# EAGLE design cwg-v2.0 (EAGLE 7.7.0)
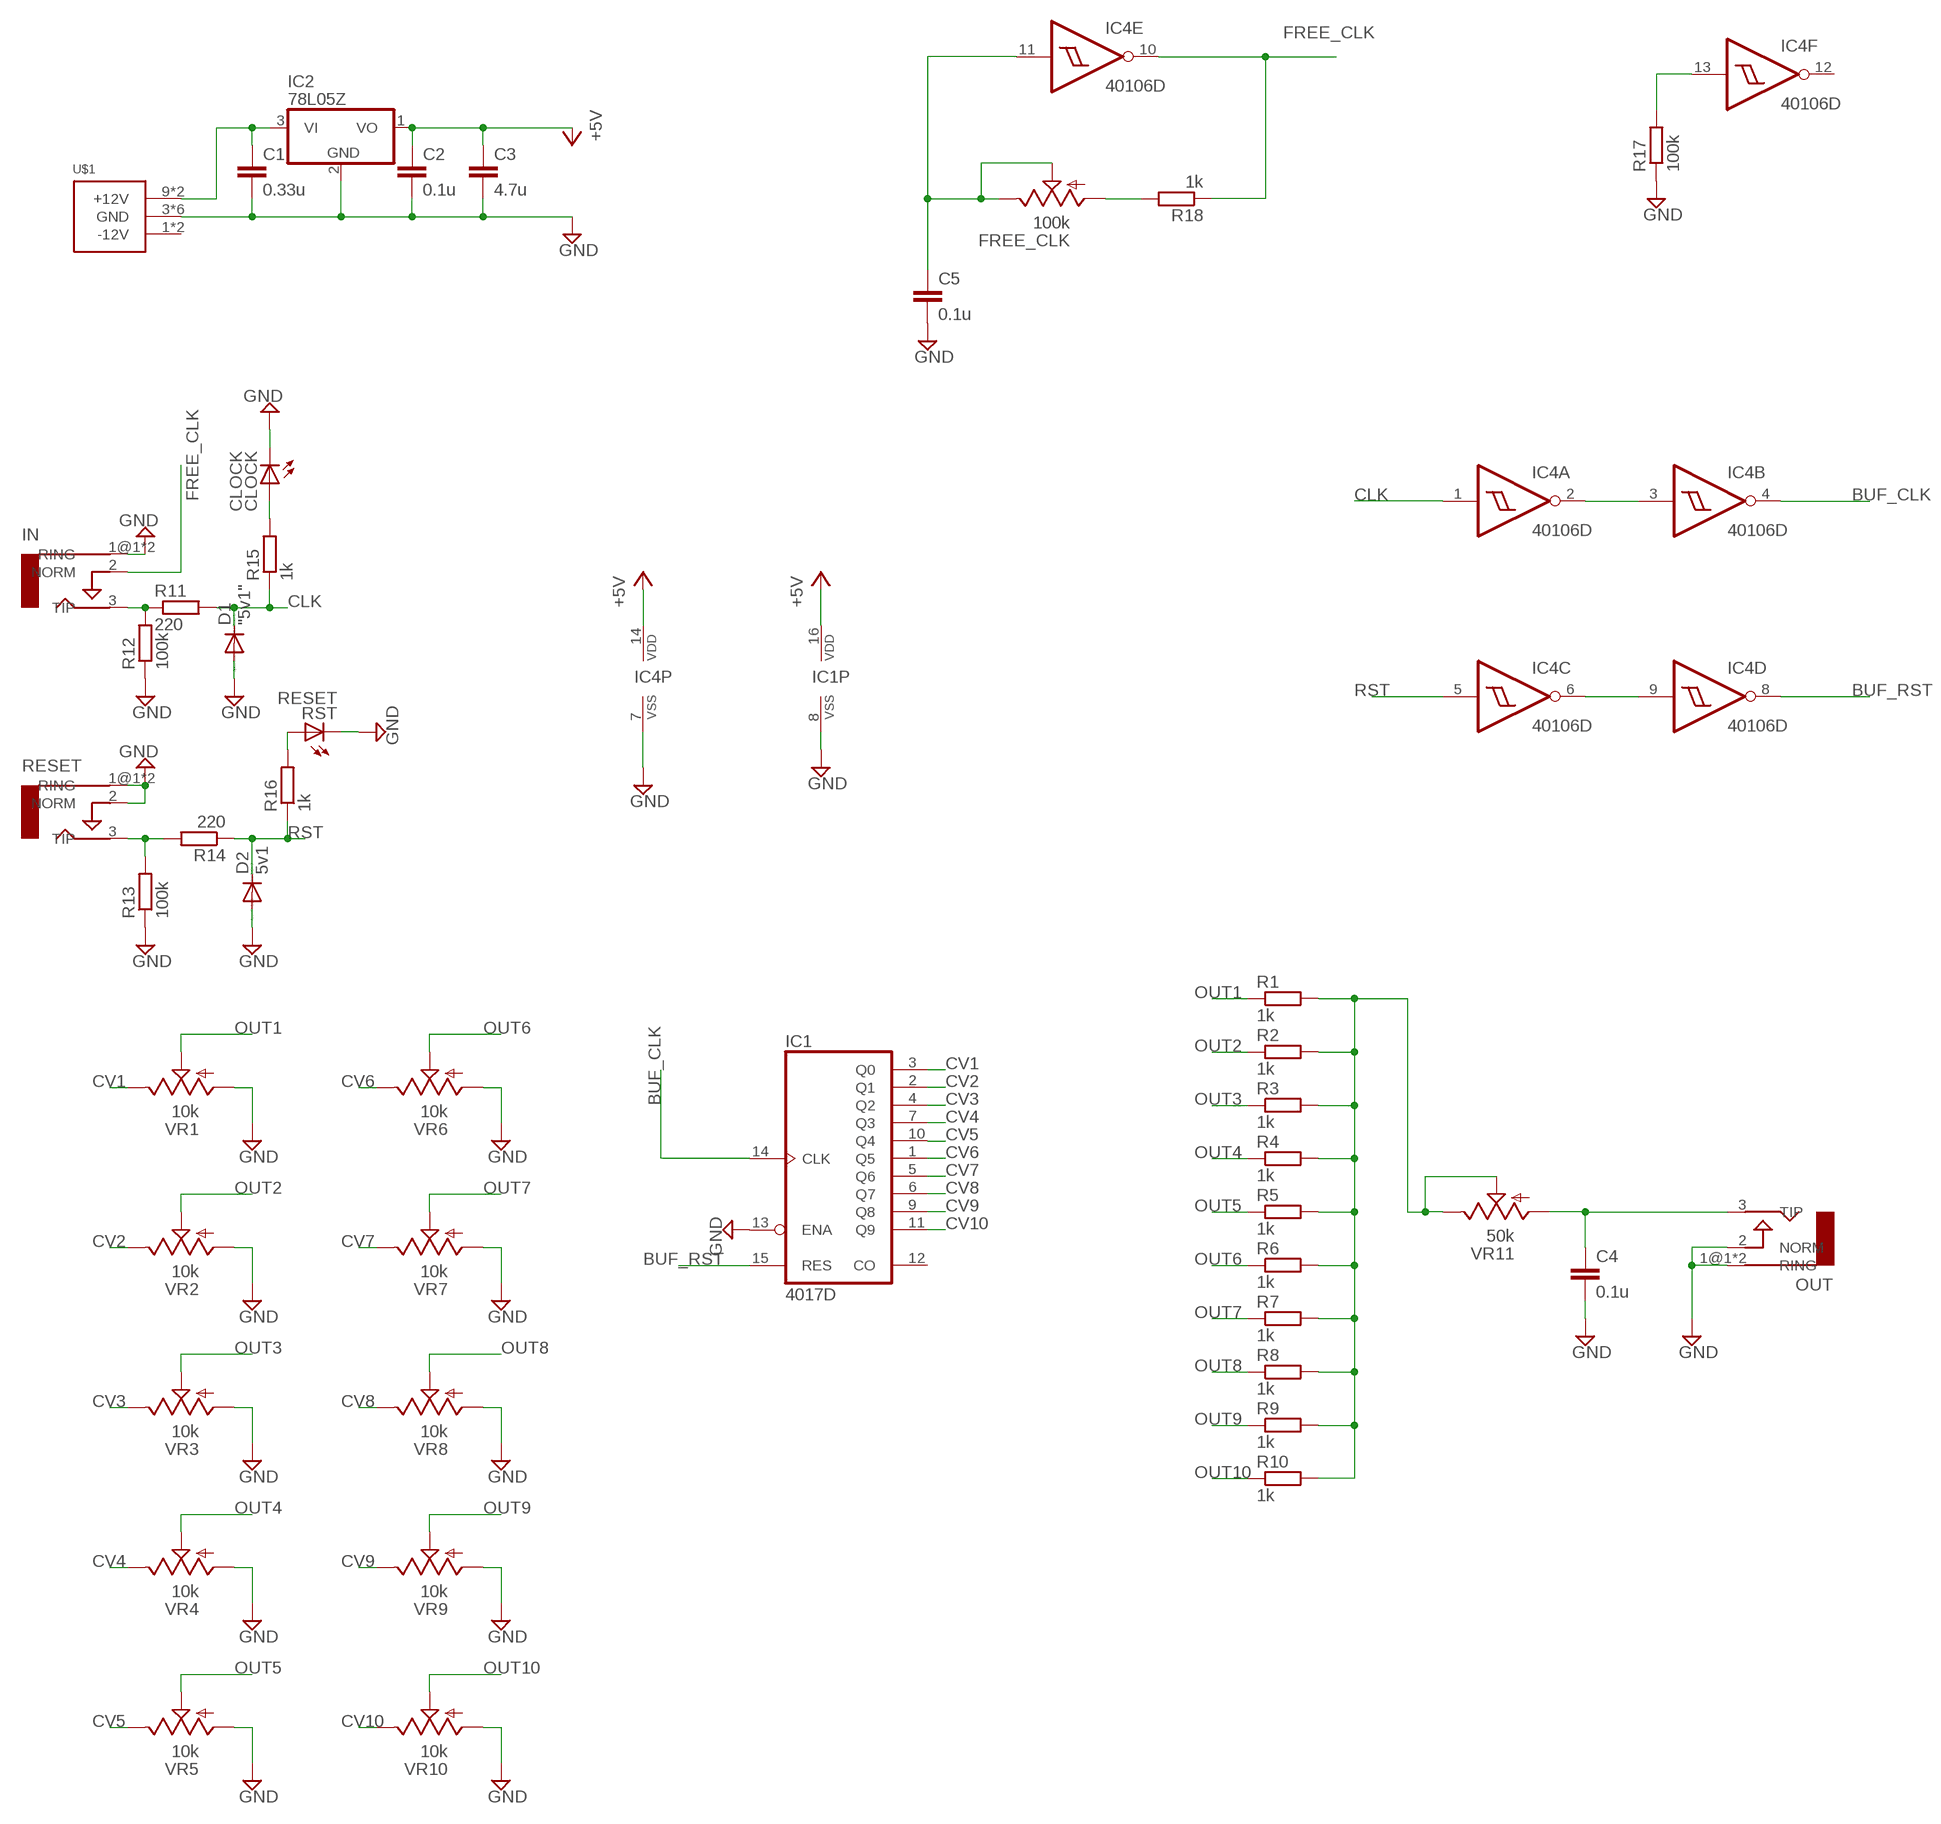
[diagram p0: schematic, sheet 1]

## Parts
C1  0.33u  C-EUC0805  [C0805]
C2  0.1u  C-EUC0805  [C0805]
C3  4.7u  C-EUC0805  [C0805]
C4  0.1u  C-EU050-025X075  [C050-025X075]
C5  0.1u  C-EUC0805  [C0805]
CLOCK  CLOCK  LEDCHIP-LED0805  [CHIP-LED0805]
D1  "5v1"  DIODE-D-2.5  [D-2.5]
D2  5v1  DIODE-D-2.5  [D-2.5]
FREE_CLK  100k  9MM_SNAP-IN_POT_  [9MM_SNAP-IN_POT]
IC1  4017D  [SO16]
IC2  78L05Z  [TO92]
IC4  40106D  [SO14]
IN  IN  AUDIO-JACKERTHENVAR  [ERTHENVAR-JACK]
OUT  OUT  AUDIO-JACKERTHENVAR  [ERTHENVAR-JACK]
R1  1k  R-EU_R0805  [R0805]
R2  1k  R-EU_R0805  [R0805]
R3  1k  R-EU_R0805  [R0805]
R4  1k  R-EU_R0805  [R0805]
R5  1k  R-EU_R0805  [R0805]
R6  1k  R-EU_R0805  [R0805]
R7  1k  R-EU_R0805  [R0805]
R8  1k  R-EU_R0805  [R0805]
R9  1k  R-EU_R0805  [R0805]
R10  1k  R-EU_R0805  [R0805]
R11  220  R-EU_R0805  [R0805]
R12  100k  R-EU_R0805  [R0805]
R13  100k  R-EU_R0805  [R0805]
R14  220  R-EU_R0805  [R0805]
R15  1k  R-EU_R0805  [R0805]
R16  1k  R-EU_R0805  [R0805]
R17  100k  R-EU_R0805  [R0805]
R18  1k  R-EU_R0805  [R0805]
RESET  RESET  AUDIO-JACKERTHENVAR  [ERTHENVAR-JACK]
RST  RESET  LEDCHIP-LED0805  [CHIP-LED0805]
U$1  POWER_SIMPLE10  [POWER_10]
VR1  10k  9MM_SNAP-IN_POT_  [9MM_SNAP-IN_POT]
VR2  10k  9MM_SNAP-IN_POT_  [9MM_SNAP-IN_POT]
VR3  10k  9MM_SNAP-IN_POT_  [9MM_SNAP-IN_POT]
VR4  10k  9MM_SNAP-IN_POT_  [9MM_SNAP-IN_POT]
VR5  10k  9MM_SNAP-IN_POT_  [9MM_SNAP-IN_POT]
VR6  10k  9MM_SNAP-IN_POT_  [9MM_SNAP-IN_POT]
VR7  10k  9MM_SNAP-IN_POT_  [9MM_SNAP-IN_POT]
VR8  10k  9MM_SNAP-IN_POT_  [9MM_SNAP-IN_POT]
VR9  10k  9MM_SNAP-IN_POT_  [9MM_SNAP-IN_POT]
VR10  10k  9MM_SNAP-IN_POT_  [9MM_SNAP-IN_POT]
VR11  50k  9MM_SNAP-IN_POT_  [9MM_SNAP-IN_POT]

## Nets
+5V: C2.1 C3.1 IC1.16(VDD) IC2.1(VO) IC4.14(P:VDD)
BUF_CLK: IC1.14(CLK) IC4.4(B:O)
BUF_RST: IC1.15(RES) IC4.8(D:O)
CLK: D1.C IC4.1(A:I) R11.2 R15.1
CV1: IC1.3(Q0) VR1.3(E)
CV2: IC1.2(Q1) VR2.3(E)
CV3: IC1.4(Q2) VR3.3(E)
CV4: IC1.7(Q3) VR4.3(E)
CV5: IC1.10(Q4) VR5.3(E)
CV6: IC1.1(Q5) VR6.3(E)
CV7: IC1.5(Q6) VR7.3(E)
CV8: IC1.6(Q7) VR8.3(E)
CV9: IC1.9(Q8) VR9.3(E)
CV10: IC1.11(Q9) VR10.3(E)
FREE_CLK: IC4.10(E:O) IN.2(NORM) R18.1
FREECLK: C5.1 FREE_CLK.2(S) FREE_CLK.3(E) IC4.11(E:I)
GND: C1.2 C2.2 C3.2 C4.2 C5.2 CLOCK.C D1.A D2.A IC1.8(VSS) IC1.13(ENA) IC2.2(GND) IC4.7(P:VSS) IN.1@1(RING) IN.1@2(RING) OUT.1@1(RING) OUT.1@2(RING) OUT.2(NORM) R12.1 R13.1 R17.1 RESET.1@1(RING) RESET.1@2(RING) RESET.2(NORM) RST.C U$1.3(GND) U$1.4(GND) U$1.5(GND) U$1.6(GND) U$1.7(GND) U$1.8(GND) VR1.1(A) VR2.1(A) VR3.1(A) VR4.1(A) VR5.1(A) VR6.1(A) VR7.1(A) VR8.1(A) VR9.1(A) VR10.1(A)
N$1: IN.3(TIP) R11.1 R12.2
N$2: CLOCK.A R15.2
N$3: IC4.2(A:O) IC4.3(B:I)
N$4: R13.2 R14.2 RESET.3(TIP)
N$5: R16.2 RST.A
N$6: C4.1 OUT.3(TIP) VR11.1(A)
N$7: IC4.6(C:O) IC4.9(D:I)
N$8: IC4.13(F:I) R17.2
N$9: C1.1 IC2.3(VI) U$1.9(+12V) U$1.10(+12V)
N$11: FREE_CLK.1(A) R18.2
N$31: R1.2 R2.2 R3.2 R4.2 R5.2 R6.2 R7.2 R8.2 R9.2 R10.2 VR11.2(S) VR11.3(E)
OUT1: R1.1 VR1.2(S)
OUT2: R2.1 VR2.2(S)
OUT3: R3.1 VR3.2(S)
OUT4: R4.1 VR4.2(S)
OUT5: R5.1 VR5.2(S)
OUT6: R6.1 VR6.2(S)
OUT7: R7.1 VR7.2(S)
OUT8: R8.1 VR8.2(S)
OUT9: R9.1 VR9.2(S)
OUT10: R10.1 VR10.2(S)
RST: D2.C IC4.5(C:I) R14.1 R16.1
Unconnected: IC1.12(CO) IC4.12(F:O) U$1.1(-12V) U$1.2(-12V)

## Library data of the parts
C1-C5 = rcl:C-EU: CAPACITOR, European symbol
CLOCK RST = led:LED: LED OSRAM: - CHIPLED LG R971, LG N971, LY N971, LG Q971, LY Q971, LO R971, LY R971 LH N974, LH R974 LS Q976, LO Q976, LY Q976 LO Q996 - Hyper CHIPLED LW Q18S LB Q993, LB Q99A, LB R99A - SideLED LS A670, LO A670, LY A670, LG A670, LP A670 LB A673, LV A673, LT A673, LW A673 LH A674 LY A675 LS A676, LA A676, LO A676, LY A676, LW A676 LS A679, LY A679, LG A679 - Hyper Micro SIDELED® LS Y876, LA Y876, LO Y876, LY Y876 LT Y87S - SmartLED LW L88C, LW L88S LB L89C, LB L89S, LG L890 LS L89K, LO L89K, LY L89K LS L896, LA L896, LO L896, LY L896 - TOPLED LS T670, LO T670, LY T670, LG T670, LP T670 LSG T670, LSP T670, LSY T670, LOP T670, LYG T670 LG T671, LOG T671, LSG T671 LB T673, LV T673, LT T673, LW T673 LH T674 LS T676, LA T676, LO T676, LY T676, LB T676, LH T676, LSB T676, LW T676 LB T67C, LV T67C, LT T67C, LS T67K, LO T67K, LY T67K, LW E67C LS E67B, LA E67B, LO E67B, LY E67B, LB E67C, LV E67C, LT E67C LW T67C LS T679, LY T679, LG T679 LS T770, LO T770, LY T770, LG T770, LP T770 LB T773, LV T773, LT T773, LW T773 LH T774 LS E675, LA E675, LY E675, LS T675 LS T776, LA T776, LO T776, LY T776, LB T776 LHGB T686 LT T68C, LB T68C - Hyper Mini TOPLED® LB M676 - Mini TOPLED Santana® LG M470 LS M47K, LO M47K, LY M47K Source: http://www.osram.convergy.de LUXEON: - LUMILED® LXK2-PW12-R00, LXK2-PW12-S00, LXK2-PW14-U00, LXK2-PW14-V00 LXK2-PM12-R00, LXK2-PM12-S00, LXK2-PM14-U00 LXK2-PE12-Q00, LXK2-PE12-R00, LXK2-PE12-S00, LXK2-PE14-T00, LXK2-PE14-U00 LXK2-PB12-K00, LXK2-PB12-L00, LXK2-PB12-M00, LXK2-PB14-N00, LXK2-PB14-P00, LXK2-PB14-Q00 LXK2-PR12-L00, LXK2-PR12-M00, LXK2-PR14-Q00, LXK2-PR14-R00 LXK2-PD12-Q00, LXK2-PD12-R00, LXK2-PD12-S00 LXK2-PH12-R00, LXK2-PH12-S00 LXK2-PL12-P00, LXK2-PL12-Q00, LXK2-PL12-R00 Source: www.luxeon.com KINGBRIGHT: KA-3528ASYC Source: www.kingbright.com
D1 D2 = diode:DIODE-: DIODE
FREE_CLK VR1-VR11 = MusicThingModular:9MM_SNAP-IN_POT: 9mm vertical snap-in pot, Alpha / Panasonic style
IC1 = 40xx:4017: COUNTER/DIVIDER
IC2 = linear:78*: Positive VOLTAGE REGULATOR Source: http://cache.national.com/ds/LM/LM78L05.pdf http://www.fairchildsemi.com/ds/LM/LM7805.pdf
IC4 = 40xx:40106: Hex SCHMITT TRIGGER
IN OUT RESET = erthenvar:AUDIO-JACK: Switching Mono 3.5mm Audio Jack from Erthenvar.
R1-R18 = rcl:R-EU_: RESISTOR, European symbol
U$1 = eurorack:POWER_SIMPLE

## Board
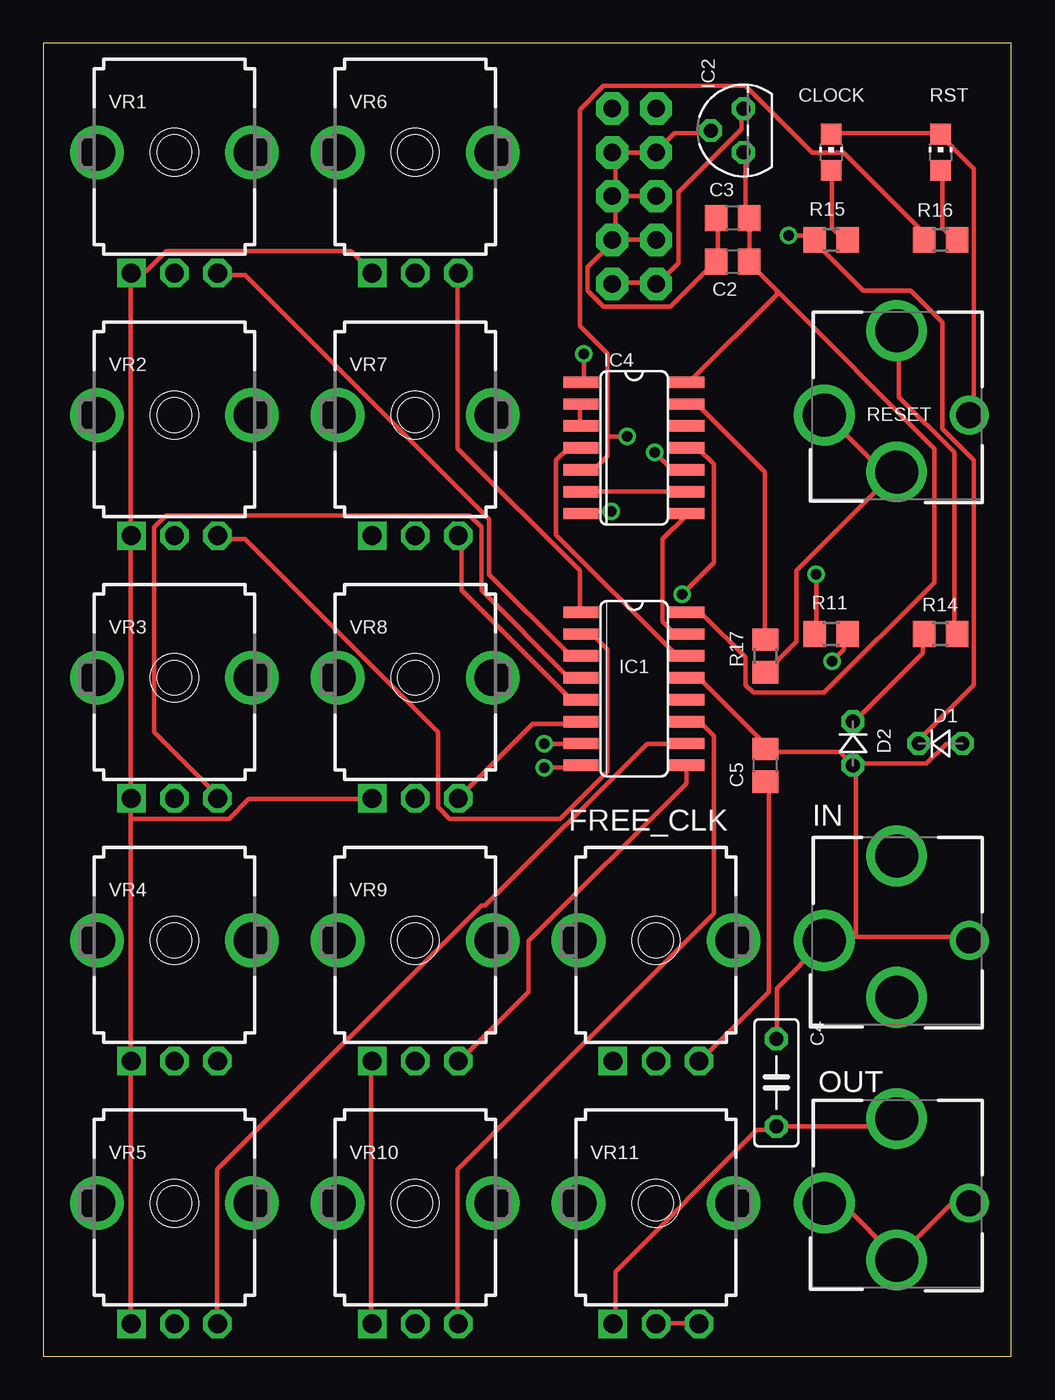
[diagram p1: board, top side]
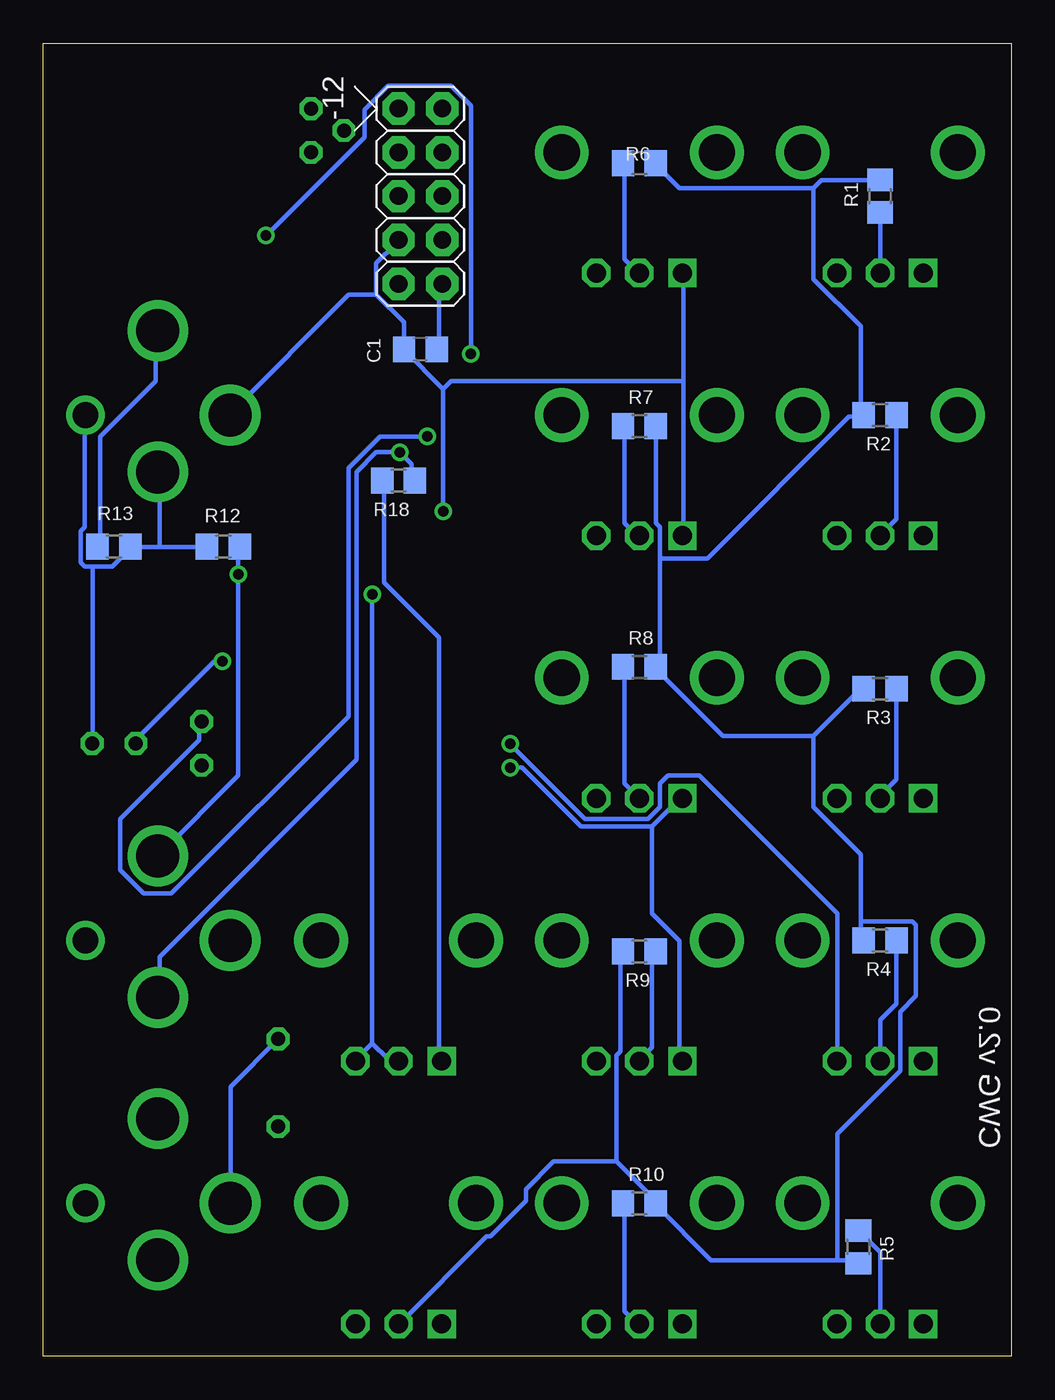
[diagram p2: board, bottom side, seen from below]

Size 56.18 x 76.19 mm. Coordinates in mm from the lower left corner, seen from the top.
Outline: 0,0 56.18,0 56.18,76.19 0,76.19 0,0
Copper layers (1*16): Top 0.035mm / dielectric 1.5mm / Bottom 0.035mm
Design rules "default": minimum track width 10mil, minimum drill 24mil, track to track 8mil, track to pad 8mil, pad to pad 8mil, via to via 8mil, smd to smd 8mil, copper to edge 40mil, drill to drill 8mil, minimum pad ring 10mil, minimum via ring 8mil, stop-mask expansion 4mil, vias tented up to drill 0mil, thermal gap 10mil

### Footprints (pad centres in the part's own frame; a part is rotated, then mirrored left to right if it is on the bottom)
C0805 = smd 1.3 x 1.5: 1 -0.95,0; 2 0.95,0
C050-025X075 = drill 0.813 octagon: 1 -2.54,0; 2 2.54,0
CHIP-LED0805 = smd 1.2 x 1.2: A 0,-1.05; C 0,1.05
D-2.5 = drill 0.813 octagon: A 1.27,0; C -1.27,0
9MM_SNAP-IN_POT = drill 1.1 square: 1 -2.5,-7 | drill 1.1 octagon: 2 0,-7; 3 2.5,-7 | drill 2.1 pad 2.794: CHASSIS1 -4.5,0; CHASSIS2 4.5,0
SO16 = smd 0.66 x 2.032: 1 -4.445,-3.073; 2 -3.175,-3.073; 3 -1.905,-3.073; 4 -0.635,-3.073; 5 0.635,-3.073; 6 1.905,-3.073; 7 3.175,-3.073; 8 4.445,-3.073; 9 4.445,3.073; 10 3.175,3.073; 11 1.905,3.073; 12 0.635,3.073; 13 -0.635,3.073; 14 -1.905,3.073; 15 -3.175,3.073; 16 -4.445,3.073
TO92 = drill 0.813 octagon: 1 -1.27,0; 2 0,1.905; 3 1.27,0
SO14 = smd 0.66 x 2.032: 1 -3.81,-3.073; 2 -2.54,-3.073; 3 -1.27,-3.073; 4 0,-3.073; 5 1.27,-3.073; 6 2.54,-3.073; 7 3.81,-3.073; 8 3.81,3.073; 9 2.54,3.073; 10 1.27,3.073; 11 0,3.073; 12 -1.27,3.073; 13 -2.54,3.073; 14 -3.81,3.073
ERTHENVAR-JACK = drill 2.5: 1@1 -4.2,0; 2 0,-3.3; 3 0,4.9 | drill 1.5: 1@2 4.2,0
R0805 = smd 1.3 x 1.5: 1 -0.95,0; 2 0.95,0
POWER_10 = drill 1.016 pad 1.88 octagon: 1 -5.08,-1.27; 2 -5.08,1.27; 3 -2.54,-1.27; 4 -2.54,1.27; 5 0,-1.27; 6 0,1.27; 7 2.54,-1.27; 8 2.54,1.27; 9 5.08,-1.27; 10 5.08,1.27

### Placement (x,y rotation side)
C1  34.29,58.42 180 bottom
C2  40,63.5 180 top
C3  40,66.04 180 top
C4  42.55,15.88 90 top
C5  41.91,34.29 90 top
CLOCK  45.72,69.85 0 top
D1  52.07,35.56 0 top
D2  46.99,35.56 270 top
FREE_CLK  35.56,24.13 0 top
IC1  34.29,38.73 270 top
IC2  40.64,71.12 90 top
IC4  34.29,52.7 270 top
IN  49.53,24.13 0 top
OUT  49.53,8.89 0 top
R1  7.62,67.31 90 bottom
R2  7.62,54.61 180 bottom
R3  7.62,38.73 180 bottom
R4  7.62,24.13 180 bottom
R5  8.89,6.35 270 bottom
R6  21.59,69.22 0 bottom
R7  21.59,53.97 0 bottom
R8  21.59,40 0 bottom
R9  21.59,23.5 180 bottom
R10  21.59,8.89 0 bottom
R11  45.72,41.91 0 top
R12  45.72,46.99 0 bottom
R13  52.07,46.99 180 bottom
R14  52.07,41.91 0 top
R15  45.72,64.77 0 top
R16  52.07,64.77 0 top
R17  41.91,40.64 90 top
R18  35.56,50.8 180 bottom
RESET  49.53,54.61 0 top
RST  52.07,69.85 0 top
U$1  34.29,67.31 270 bottom
VR1  7.62,69.85 0 top
VR2  7.62,54.61 0 top
VR3  7.62,39.37 0 top
VR4  7.62,24.13 0 top
VR5  7.62,8.89 0 top
VR6  21.59,69.85 0 top
VR7  21.59,54.61 0 top
VR8  21.59,39.37 0 top
VR9  21.59,24.13 0 top
VR10  21.59,8.89 0 top
VR11  35.56,8.89 0 top

### Tracks (layer width: path | path; a pad name or v marks a point on that pad's centre or on a via)
+5V
  Top 0.254: 42.57,61.82 40.97,63.42 C2.1 40.97,63.65 40.97,65.94 C3.1 40.74,66.17 40.74,69.83 IC2.1 | 42.57,61.82 51.71,52.68 51.71,44.91 45.31,38.51 41.2,38.51 40.74,38.96 40.74,40.56 38.23,43.08 37.54,43.08 IC1.16 | 42.57,61.82 42.57,61.59 37.54,56.57 IC4.14
BUF_CLK
  Top 0.254: IC4.4 31.14,52.68 30.45,52.68 29.77,51.99 29.77,47.65 36.63,40.79 37.31,40.79 IC1.14
BUF_RST
  Top 0.254: IC1.15 37.31,41.93 36.63,41.93 35.94,42.62 35.94,47.42 37.31,48.79 IC4.8
CLK  (via drill 0.61)
  Top 0.254: v45.77,40.33 46.46,41.02 46.46,41.71 R11.2 | D1.C 50.8,35.76 54,38.96 54,51.99 52.17,53.82 52.17,59.99 50.34,61.82 47.6,61.82 44.86,64.57 R15.1 44.63,64.8 44.4,65.02 v43.26,65.02 | v31.37,58.17 31.37,56.57 IC4.1
  Bottom 0.254: v45.77,40.33 46.23,40.33 50.8,35.76 D1.C | v31.37,58.17 31.37,72.57 32.51,73.71 36.17,73.71 37.54,72.34 37.54,70.74 v43.26,65.02
CV1
  Top 0.254: IC1.3 31.14,40.79 30.45,40.79 25.88,45.36 25.88,48.56 11.71,62.74 10.34,62.74 VR1.3
CV2
  Top 0.254: IC1.2 31.37,41.71 32.05,41.71 32.74,41.02 32.74,33.93 30,31.19 23.6,31.19 22.91,31.88 22.91,36.22 11.71,47.42 10.34,47.42 VR2.3
CV3
  Top 0.254: IC1.4 31.14,39.42 30.45,39.42 25.42,44.45 25.42,48.11 24.74,48.79 7.14,48.79 6.45,48.11 6.45,36.22 10.11,32.56 VR3.3
CV4  (via drill 0.61)
  Top 0.254: v29.08,35.53 31.14,35.53 IC1.7
  Bottom 0.254: v29.08,35.53 24.74,31.19 21.08,31.19 20.4,31.88 20.4,33.25 19.94,33.71 18.11,33.71 10.11,25.71 10.11,17.25 VR4.3
CV5
  Top 0.254: IC1.10 37.31,35.53 35.03,35.53 25.65,26.16 25.42,26.16 10.11,10.85 10.11,1.93 VR5.3
CV6
  Top 0.254: IC1.1 31.14,43.31 31.14,45.59 24.05,52.68 24.05,62.74 VR6.3
CV7
  Top 0.254: IC1.5 31.14,38.28 30.45,38.28 24.28,44.45 24.28,47.42 VR7.3
CV8
  Top 0.254: IC1.6 31.14,36.68 28.4,36.68 24.28,32.56 VR8.3
CV9
  Top 0.254: IC1.9 37.31,34.16 37.31,33.25 28.17,24.11 28.17,21.13 24.28,17.25 VR9.3
CV10
  Top 0.254: IC1.11 37.54,36.68 38.23,36.68 38.91,35.99 38.91,25.71 24.05,10.85 24.05,1.93 VR10.3
FREE_CLK  (via drill 0.61)
  Top 0.254: v35.48,52.45 36.4,51.54 37.31,51.54 IC4.10
  Bottom 0.254: R18.1 34.8,50.85 34.8,51.76 v35.48,52.45 36.85,52.45 38,51.31 38,34.62 49.43,23.19 49.43,20.9 IN.2
FREECLK  (via drill 0.61)
  Top 0.254: C5.1 42.11,33.25 42.11,21.13 38.23,17.25 FREE_CLK.3 | v37.08,44.22 38.91,46.05 38.91,51.76 38,52.68 37.54,52.68 IC4.11
  Bottom 0.254: 37.08,18.16 v37.08,44.22 | 37.08,18.16 38,17.25 FREE_CLK.3 | 37.08,18.16 36.17,17.25 35.71,17.25 FREE_CLK.2
GND  (via drill 0.61)
  Top 0.254: v29.08,34.16 31.14,34.16 IC1.8 | VR10.1 19.02,1.93 19.02,17.02 VR9.1 | VR5.1 5.08,1.93 5.08,17.02 VR4.1 5.08,17.25 5.08,31.19 | 5.08,31.19 5.08,32.33 VR3.1 5.08,32.56 5.08,47.42 VR2.1 5.08,47.65 5.08,62.74 VR1.1 5.31,62.97 5.99,62.97 7.14,64.11 17.88,64.11 19.02,62.97 VR6.1 | 5.08,31.19 10.79,31.19 11.94,32.33 19.02,32.33 VR8.1 | U$1.5 33.2,67.31 | IC2.2 38.68,70.97 36.63,70.97 35.71,70.05 U$1.3 35.48,69.83 33.2,69.83 | 33.2,69.83 33.2,67.31 | 33.2,69.83 U$1.4 | C3.2 39.14,65.94 39.14,63.65 C2.2 38.91,63.42 36.4,60.91 32.51,60.91 31.6,61.82 31.6,63.2 32.97,64.57 U$1.8 33.2,64.8 | v32.97,49.02 31.37,49.02 IC4.7 | 33.2,64.8 35.48,64.8 U$1.7 | 33.2,64.8 33.2,67.31 | 33.2,67.31 U$1.6 | CLOCK.C 45.77,70.97 51.94,70.97 RST.C 52.17,70.74 54,68.91 54,54.97 53.77,54.74 RESET.1@2 | 49.2,51.08 49.43,51.31 RESET.2 49.2,51.08 | 49.2,51.08 43.71,45.59 43.71,41.48 42.11,39.88 R17.1 | 49.2,51.08 48.97,51.08 45.54,54.51 RESET.1@1 | OUT.1@2 53.54,8.79 52.63,8.79 49.66,5.82 OUT.2 49.43,5.82 46.46,8.79 45.54,8.79 OUT.1@1 | D2.A 46.91,34.39 46.23,35.08 42.11,35.08 C5.2 42.11,35.31 38.23,39.19 37.54,39.19 IC1.13 | D1.A 53.31,35.53 52.4,35.53 51.26,34.39 47.14,34.39 D2.A | C4.2 42.57,18.62 42.57,21.36 45.31,24.11 IN.1@1 45.54,24.33 47.14,24.33 | 47.14,24.33 53.54,24.33 IN.1@2 | 47.14,24.33 47.14,34.16 D2.A
  Bottom 0.254: v29.08,34.16 28.4,34.16 24.97,30.73 20.85,30.73 | 20.85,30.73 19.25,32.33 VR8.1 | 20.85,30.73 20.85,25.71 19.25,24.11 19.25,17.25 VR9.1 | 19.02,56.57 19.02,62.74 VR6.1 | 19.02,56.57 19.02,47.65 VR7.1 | 36.85,61.59 35.25,59.99 35.25,58.62 C1.2 35.25,58.39 32.97,56.11 | 36.85,61.59 36.85,63.42 35.71,64.57 U$1.7 | 32.97,56.11 v32.97,49.02 | 19.02,56.57 32.51,56.57 32.97,56.11 | 51.03,46.96 49.43,46.96 | 49.43,46.96 46.68,46.96 R12.1 | 49.43,46.96 49.43,51.31 RESET.2 | 53.31,45.82 52.17,45.82 51.03,46.96 | 53.31,45.82 53.77,45.82 54,46.05 54,47.88 53.77,48.11 53.77,54.51 RESET.1@2 | 51.03,46.96 R13.1 | C4.2 45.31,15.65 45.31,9.02 OUT.1@1 | 53.31,45.82 53.31,35.76 D1.A | 36.85,61.59 38.46,61.59 45.31,54.74 RESET.1@1
N$1  (via drill 0.61)
  Top 0.254: v44.86,45.36 44.86,41.93 R11.1
  Bottom 0.254: R12.2 44.86,46.96 v44.86,45.36 44.86,33.71 49.43,29.13 IN.3
N$2
  Top 0.254: CLOCK.A 45.77,68.68 45.77,65.48 46.46,64.8 R15.2
N$3
  Top 0.254: IC4.3 31.14,54.05 31.14,55.19 IC4.2
N$4
  Top 0.254: R14.2 52.86,41.93 52.86,52.45 49.66,55.65 49.66,59.31 RESET.3
  Bottom 0.254: R13.2 52.86,47.19 52.86,53.36 49.66,56.57 49.66,59.31 RESET.3
N$5
  Top 0.254: RST.A 52.17,68.68 52.17,65.48 52.86,64.8 R16.2
N$6
  Top 0.254: OUT.3 49.43,13.59 49.2,13.36 42.57,13.36 C4.1 42.34,13.13 41.43,13.13 33.2,4.9 33.2,1.93 VR11.1
N$7
  Top 0.254: IC4.9 IC4.6
N$8
  Top 0.254: R17.2 41.88,41.71 41.88,51.31 38,55.19 37.54,55.19 IC4.13
N$9
  Top 0.254: IC2.3 40.51,72.34 40.51,71.2 36.85,67.54 36.85,63.42 35.71,62.28 U$1.9 35.48,62.28 33.2,62.28 U$1.10
  Bottom 0.254: C1.1 33.2,58.62 33.2,62.05 U$1.10
N$11
  Bottom 0.254: R18.2 36.4,50.62 36.4,44.91 33.2,41.71 33.2,17.25 FREE_CLK.1
N$31
  Top 0.254: VR11.2 35.71,1.93 38,1.93 VR11.3
  Bottom 0.254: 10.11,5.59 17.42,5.59 20.62,8.79 R10.2 20.62,9.02 22.91,11.3 | 10.11,5.59 8.97,5.59 R5.2 | 22.91,11.3 22.91,17.48 22.68,17.7 22.68,23.42 R9.2 | 22.91,11.3 26.57,11.3 28.17,9.7 28.17,9.02 30.23,6.96 30.45,6.96 35.48,1.93 VR11.2 | 11.48,67.77 11.02,68.22 7.82,68.22 R1.2 | 11.48,67.77 19.25,67.77 20.62,69.14 R6.2 | 11.48,67.77 11.48,62.51 8.74,59.77 8.74,54.74 R2.2 8.74,54.51 9.42,54.51 17.65,46.28 20.4,46.28 | 8.74,25.25 8.74,29.13 11.48,31.88 11.48,35.99 | 8.74,25.25 8.74,24.33 R4.2 | 11.48,35.99 8.74,38.73 R3.2 | 11.48,35.99 16.74,35.99 20.62,39.88 R8.2 20.62,40.11 20.4,40.33 20.4,46.28 | 20.4,46.28 20.4,48.11 20.62,48.34 20.62,53.82 R7.2 | 10.11,5.59 10.11,12.9 6.45,16.56 6.45,19.99 5.54,20.9 5.54,25.02 5.77,25.25 8.74,25.25
OUT1
  Bottom 0.254: R1.1 7.6,66.17 7.6,62.97 VR1.2
OUT2
  Bottom 0.254: R2.1 6.68,54.51 6.68,48.56 7.6,47.65 VR2.2
OUT3
  Bottom 0.254: R3.1 6.68,33.48 7.6,32.56 VR3.2
OUT4
  Bottom 0.254: R4.1 6.68,24.11 6.68,20.45 7.6,19.53 7.6,17.25 VR4.2
OUT5
  Bottom 0.254: R5.1 8.74,7.19 7.6,6.04 7.6,1.93 VR5.2
OUT6
  Bottom 0.254: R6.1 22.45,69.14 22.45,63.65 21.77,62.97 VR6.2
OUT7
  Bottom 0.254: R7.1 22.45,53.82 22.45,48.34 21.77,47.65 VR7.2
OUT8
  Bottom 0.254: R8.1 22.45,39.88 22.45,33.25 21.77,32.56 VR8.2
OUT9
  Bottom 0.254: R9.1 20.85,23.42 20.85,17.93 21.54,17.25 VR9.2
OUT10
  Bottom 0.254: R10.1 22.45,8.79 22.45,2.62 21.77,1.93 VR10.2
RST  (via drill 0.61)
  Top 0.254: R14.1 51.03,41.71 51.03,40.79 47.14,36.91 D2.C | 32.74,53.36 32.74,52.22 32.05,51.54 31.37,51.54 IC4.5 | 32.74,53.36 32.74,58.17 31.14,59.77 31.14,72.34 32.51,73.71 40.74,73.71 44.63,69.83 46.46,69.83 51.03,65.25 51.03,64.8 R16.1 | 32.74,53.36 v33.88,53.36
  Bottom 0.254: v33.88,53.36 36.63,53.36 38.46,51.54 38.46,37.13 48.74,26.85 50.34,26.85 51.71,28.22 51.71,31.19 47.14,35.76 47.14,36.68 D2.C

### Text on the board
bNames: CWG v2.0